# Altium project STM32VET6_board.PrjPcb
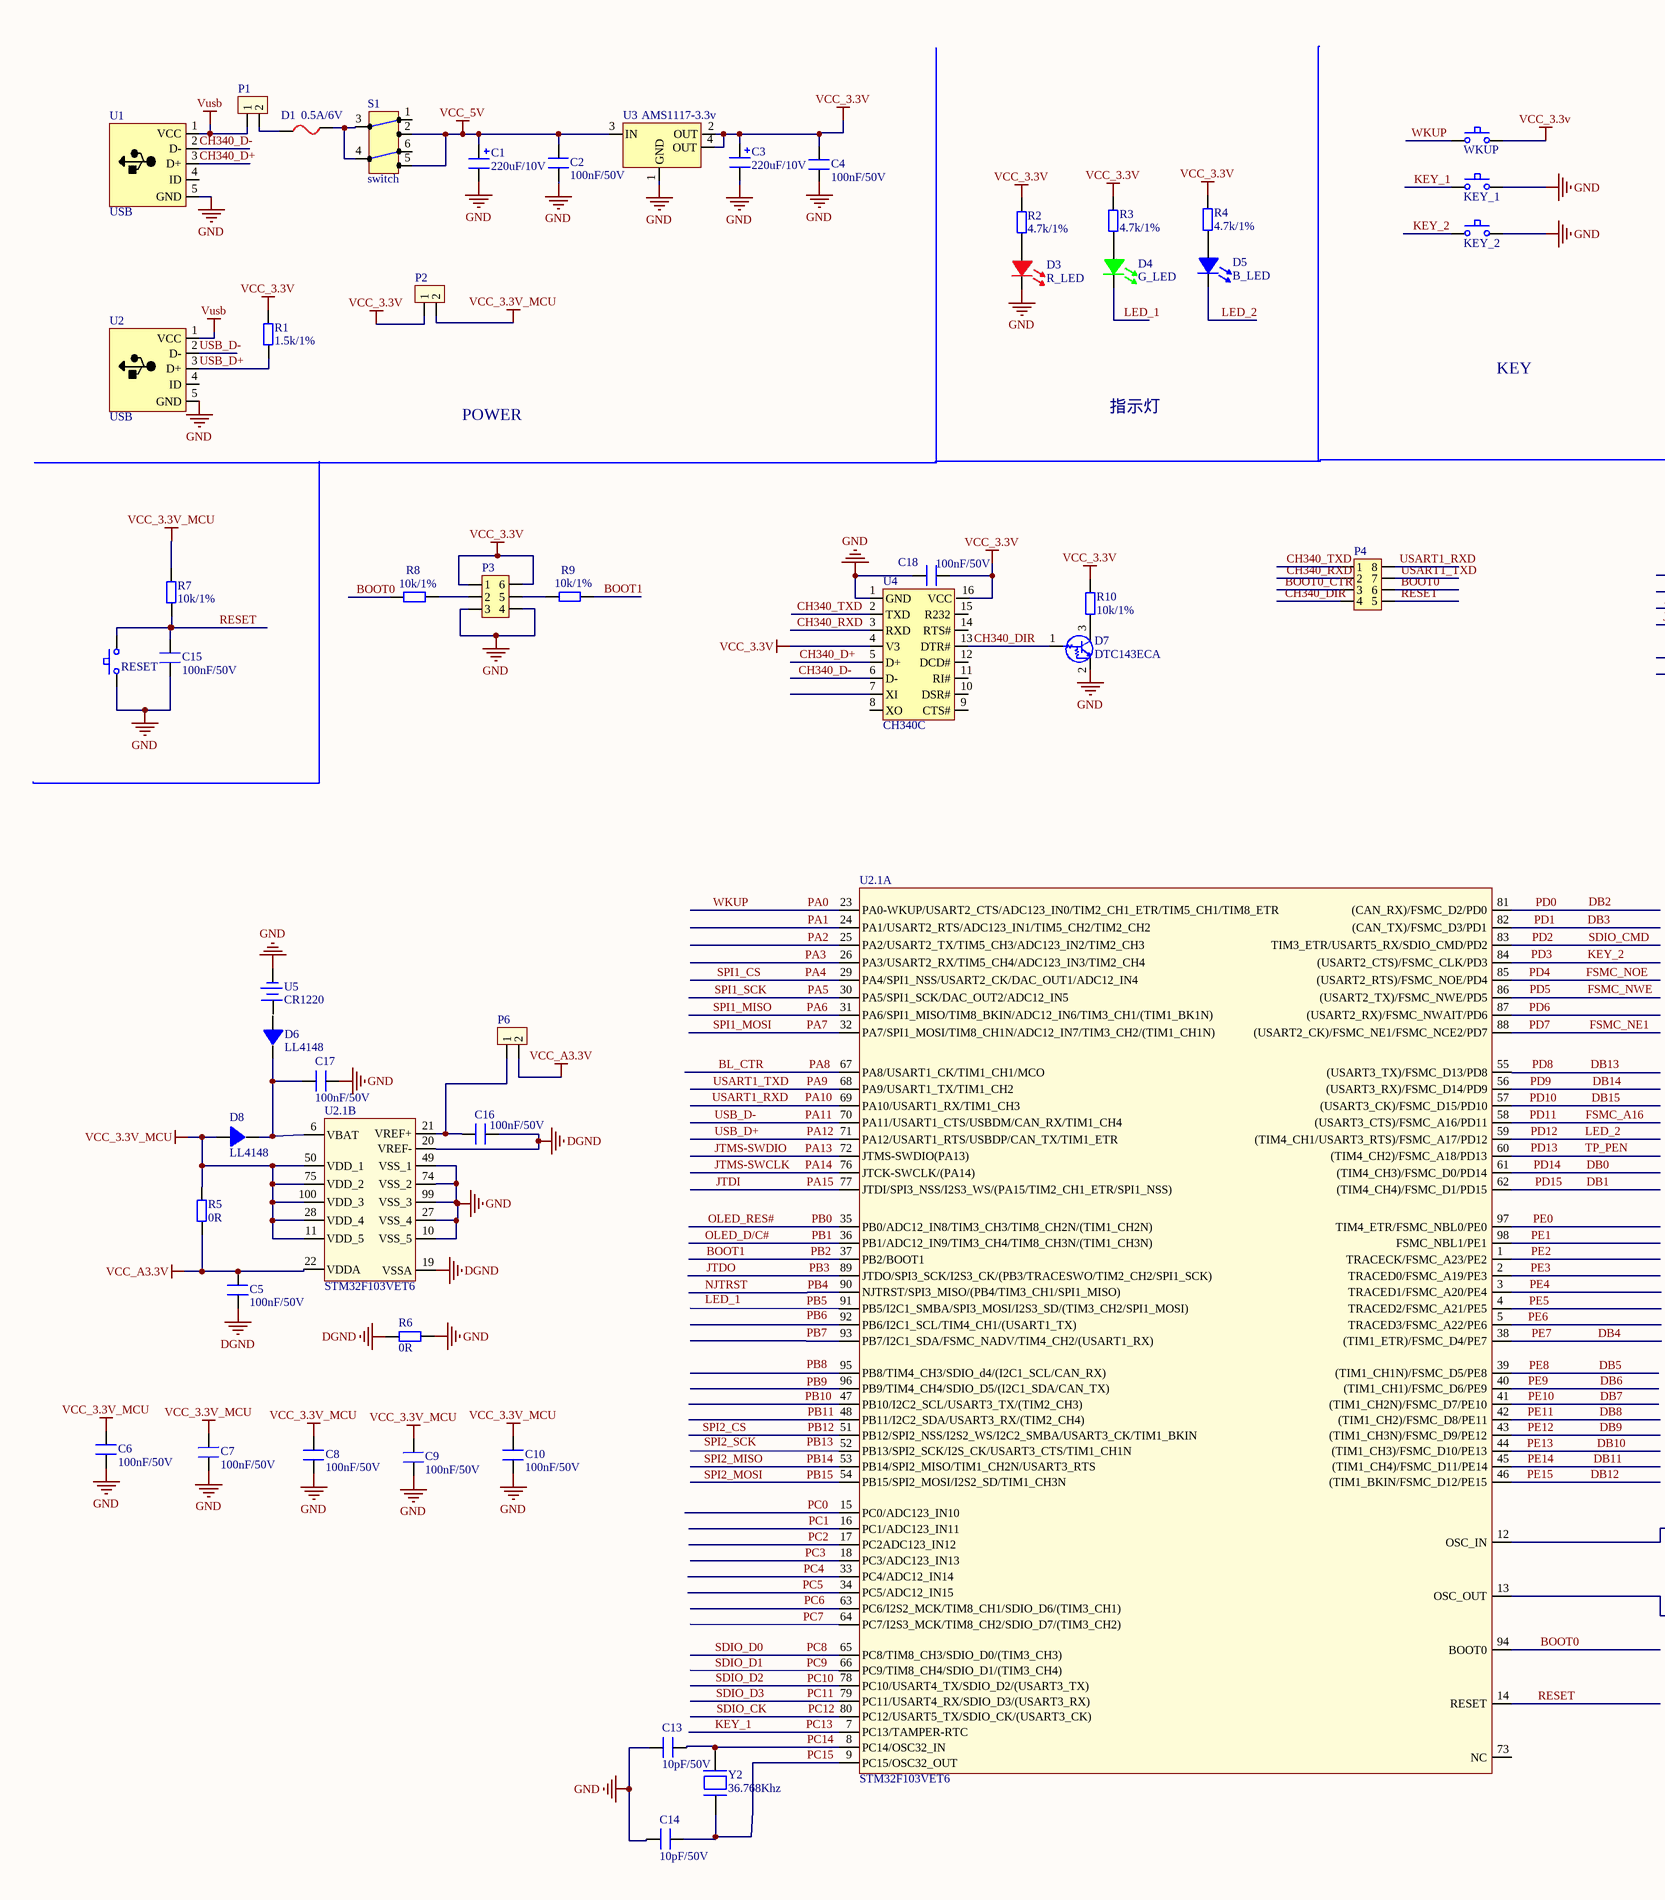
[diagram p0: STM32VET6_SCH.SchDoc, left]
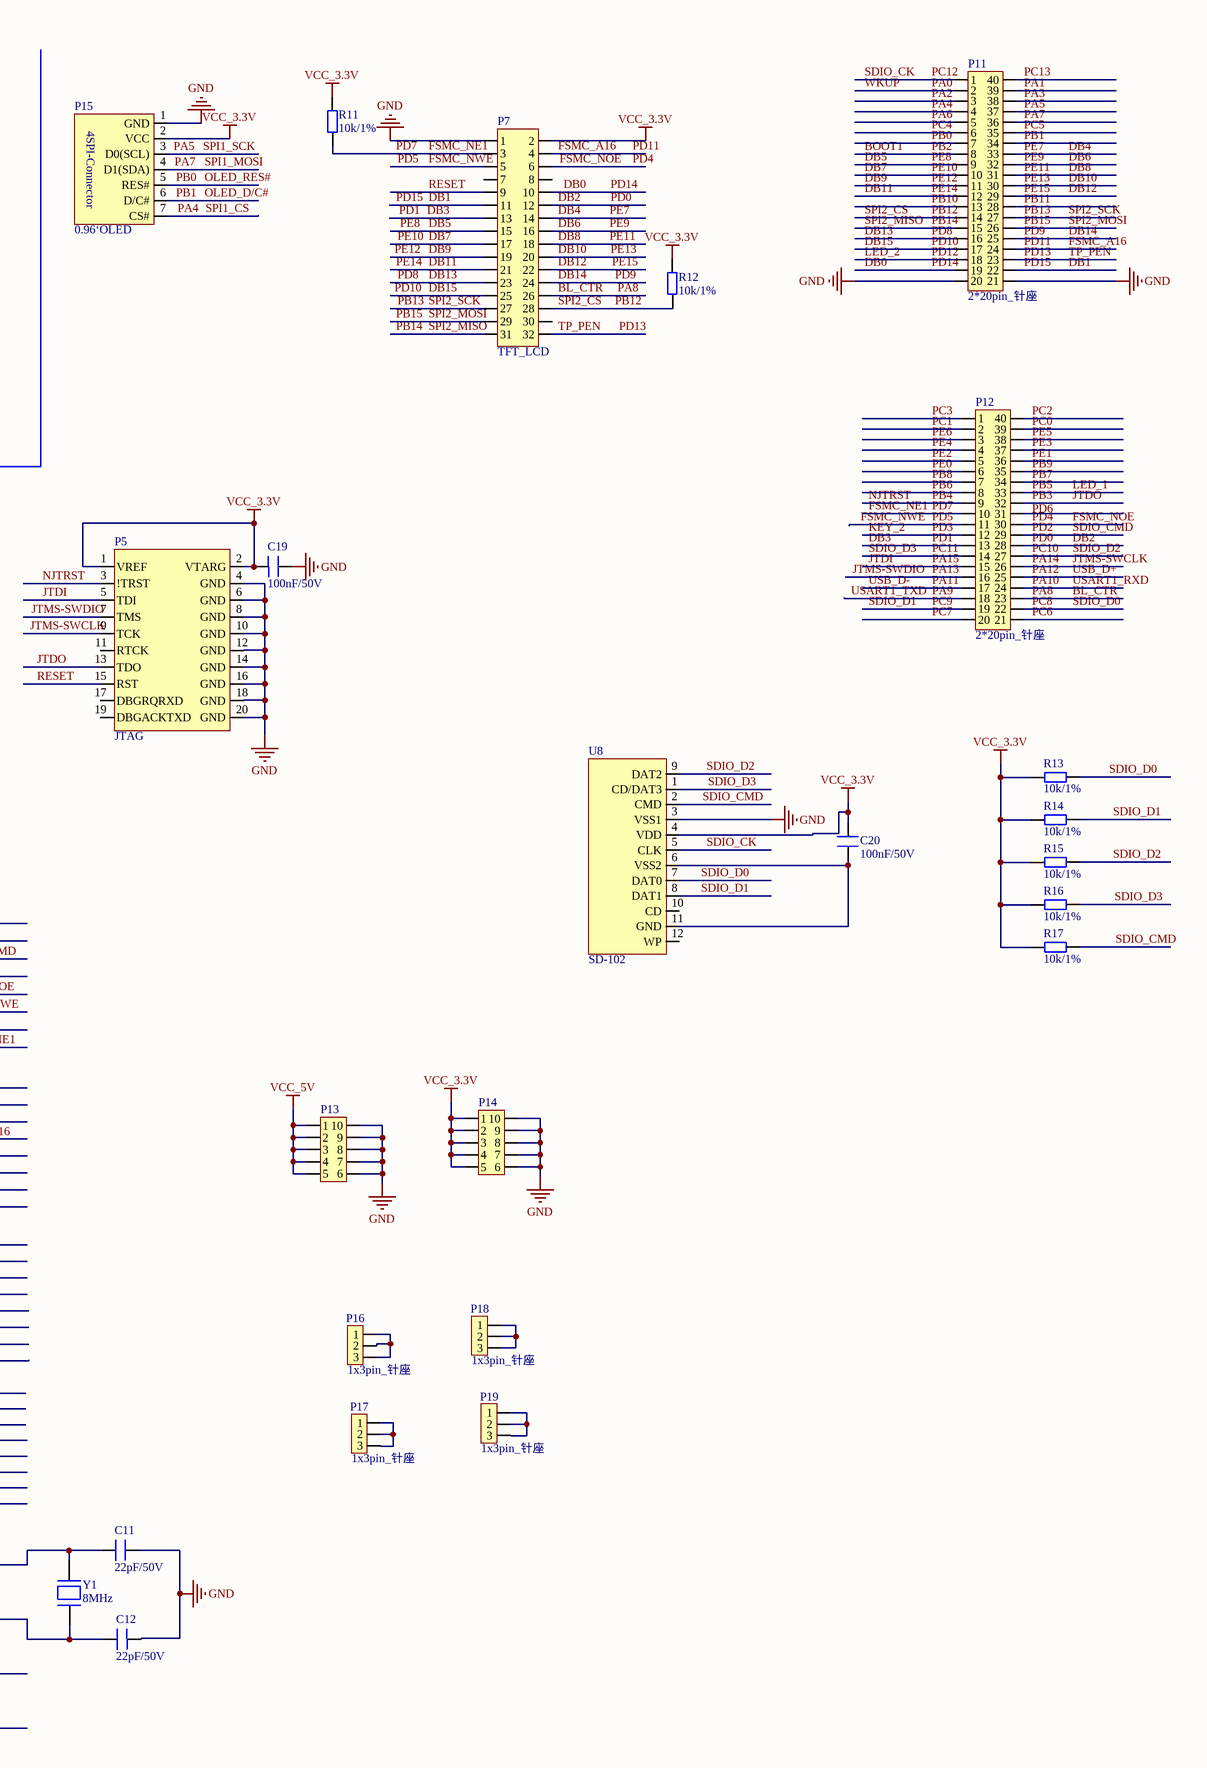
[diagram p1: STM32VET6_SCH.SchDoc, right]
1 sheet, 74 parts. Net scope: global (net labels, ports and power ports of the same name join across sheets).
Board file: STM32VET6_PCB.PcbDoc

## Sheet STM32VET6_SCH.SchDoc
size A2

### Parts
C1  220uF/10V  [CT 6*6 - C]
C2  100nF/50V  [0603_C]
C3  220uF/10V  [CT 6*6 - C]
C4  100nF/50V  [0603_C]
C5  100nF/50V  [0603_C]
C6  100nF/50V  [0603_C]
C7  100nF/50V  [0603_C]
C8  100nF/50V  [0603_C]
C9  100nF/50V  [0603_C]
C10  100nF/50V  [0603_C]
C11  22pF/50V  [0603_C]
C12  22pF/50V  [0603_C]
C13  10pF/50V  [0603_C]
C14  10pF/50V  [0603_C]
C15  100nF/50V  [0603_C]
C16  100nF/50V  [0603_C]
C17  100nF/50V  [0603_C]
C18  100nF/50V  [0603_C]
C19  100nF/50V  [0603_C]
C20  100nF/50V  [0603_C]
D1  0.5A/6V  [0805_D]
D3  R_LED  [0603_R]
D4  G_LED  [0603_R]
D5  B_LED  [0603_R]
D6  LL4148  [LL4148]
D7  DTC143ECA  [SOT23]
D8  LL4148  [LL4148]
key0  WKUP  [TSW SMD-3*6*5]
Key1  KEY_1  [TSW SMD-3*6*5]
Key2  KEY_2  [TSW SMD-3*6*5]
key_4  RESET  [TSW SMD-3*6*5]
P1  2P_排针  [HDR2.54-LI-2P]  (value not drawn)
P2  2P_排针  [HDR2.54-LI-2P]  (value not drawn)
P3  2*3Pin_插针  [HDR2.54-LI-2x3P]  (value not drawn)
P4  2x4pin_插针  [HDR2.54-LI-2x4P]  (value not drawn)
P5  JTAG  [DC-2.54-L-Z-20P]
P6  2P_排针  [HDR2.54-LI-2P]  (value not drawn)
P7  TFT_LCD  [HDR2.54-M-2x16P]
P11  2*20pin_针座  [HDR2.54-LI-2x20P]
P12  2*20pin_针座  [HDR2.54-LI-2x20P]
P13  2x5pin_针座  [HDR2.54-LI-2x5P]  (value not drawn)
P14  2x5pin_针座  [HDR2.54-LI-2x5P]  (value not drawn)
P15  0.96‘OLED  [0.96'OLED]
P16  1x3pin_针座  [HDR2.54-LI-3P]
P17  1x3pin_针座  [HDR2.54-LI-3P]
P18  1x3pin_针座  [HDR2.54-LI-3P]
P19  1x3pin_针座  [HDR2.54-LI-3P]
R1  1.5k/1%  [0603_R]
R2  4.7k/1%  [0603_R]
R3  4.7k/1%  [0603_R]
R4  4.7k/1%  [0603_R]
R5  0R  [0603_R]
R6  0R  [0603_R]
R7  10k/1%  [0603_R]
R8  10k/1%  [0603_R]
R9  10k/1%  [0603_R]
R10  10k/1%  [0603_R]
R11  10k/1%  [0603_R]
R12  10k/1%  [0603_R]
R13  10k/1%  [0603_R]
R14  10k/1%  [0603_R]
R15  10k/1%  [0603_R]
R16  10k/1%  [0603_R]
R17  10k/1%  [0603_R]
S1  switch  [KFT DIP-8X8]
U1  USB  [USB-MINI-5P]
U2  USB  [USB-MINI-5P]
U2.1  STM32F103VET6  [STM32F103VET6]  (parts A,B of 2)
U3  AMS1117-3.3v  [SOT-223]
U4  CH340C  [SOP16]
U5  CR1220  [CR1220]
U8  SD-102  [SDCARD_L]
Y1  8MHz  [8Mhz]
Y2  36.768Khz  [32.768Khz晶振]

### Nets
DGND: C5.1 C16.2 R6.2 U2.1.19(VSSA) U2.1.20(VREF-)
GND: C1.2 C2.1 C3.2 C6.1 C7.1 C8.1 C9.1 C10.1 C11.2 C12.2 C13.1 C14.1 C15.1 C17.2 C18.1 C19.2 D3.2 D7.2 Key1.2 Key2.2 key_4.1 P3.3 P3.4 P5.4(GND) P5.6(GND) P5.8(GND) P5.10(GND) P5.12(GND) P5.14(GND) P5.16(GND) P5.18(GND) P5.20(GND) P7.1 P11.20 P11.21 P13.6 P13.7 P13.8 P13.9 P13.10 P14.6 P14.7 P14.8 P14.9 P14.10 P15.1(GND) R6.1 U1.5(GND) U2.5(GND) U2.1.10(VSS_5) U2.1.27(VSS_4) U2.1.49(VSS_1) U2.1.74(VSS_2) U2.1.99(VSS_3) U3.1(GND) U4.1(GND) U5.2 U8.3(VSS1)
VCC_3.3V: C3.1 C4.2 C18.2 C19.1 C20.2 key0.2 P2.1 P3.1 P3.6 P5.1(VREF) P5.2(VTARG) P7.2 P14.1 P14.2 P14.3 P14.4 P14.5 P15.2(VCC) R1.2 R2.2 R3.2 R4.2 R10.1 R11.2 R12.2 R13.2 R14.2 R15.2 R16.2 R17.2 U3.2(OUT) U3.4(OUT) U4.4(V3) U4.16(VCC) U8.4(VDD)
VCC_3.3V_MCU: C6.2 C7.2 C8.2 C9.2 C10.2 D8.1 P2.2 R5.2 R7.2 U2.1.11(VDD_5) U2.1.28(VDD_4) U2.1.50(VDD_1) U2.1.75(VDD_2) U2.1.100(VDD_3)
VCC_5V: C1.1 C2.2 P13.1 P13.2 P13.3 P13.4 P13.5 S1.2 S1.5 U3.3(IN)
VCC_A3.3V: C5.2 P6.2 R5.1 U2.1.22(VDDA)
Vusb: P1.1 U1.1(VCC) U2.1(VCC)
BL_CTR: P7.26 P12.23 U2.1.67(PA8/USART1_CK/TIM1_CH1/MCO)  [also labelled PA8]
BOOT0: P4.6 R8.2 U2.1.94(BOOT0)
BOOT0_CTR: P4.3
BOOT1: P11.8 R9.1 U2.1.37(PB2/BOOT1)  [also labelled PB2]
CH340_D+: U1.3(D+) U4.5(D+)
CH340_D-: U1.2(D-) U4.6(D-)
CH340_DIR: D7.1 P4.4 U4.13(DTR#)
CH340_RXD: P4.2 U4.3(RXD)
CH340_TXD: P4.1 U4.2(TXD)
DB0: P7.10 P11.19 U2.1.61((TIM4_CH3)/FSMC_D0/PD14)  [also labelled PD14]
DB1: P7.11 P11.22 U2.1.62((TIM4_CH4)/FSMC_D1/PD15)  [also labelled PD15]
DB2: P7.12 P12.28 U2.1.81((CAN_RX)/FSMC_D2/PD0)  [also labelled PD0]
DB3: P7.13 P12.13 U2.1.82((CAN_TX)/FSMC_D3/PD1)  [also labelled PD1]
DB4: P7.14 P11.33 U2.1.38((TIM1_ETR)/FSMC_D4/PE7)  [also labelled PE7]
DB5: P7.15 P11.9 U2.1.39((TIM1_CH1N)/FSMC_D5/PE8)  [also labelled PE8]
DB6: P7.16 P11.32 U2.1.40((TIM1_CH1)/FSMC_D6/PE9)  [also labelled PE9]
DB7: P7.17 P11.10 U2.1.41((TIM1_CH2N)/FSMC_D7/PE10)  [also labelled PE10]
DB8: P7.18 P11.31 U2.1.42((TIM1_CH2)/FSMC_D8/PE11)  [also labelled PE11]
DB9: P7.19 P11.11 U2.1.43((TIM1_CH3N)/FSMC_D9/PE12)  [also labelled PE12]
DB10: P7.20 P11.30 U2.1.44((TIM1_CH3)/FSMC_D10/PE13)  [also labelled PE13]
DB11: P7.21 P11.12 U2.1.45((TIM1_CH4)/FSMC_D11/PE14)  [also labelled PE14]
DB12: P7.22 P11.29 U2.1.46((TIM1_BKIN/FSMC_D12/PE15)  [also labelled PE15]
DB13: P7.23 P11.16 U2.1.55((USART3_TX)/FSMC_D13/PD8)  [also labelled PD8]
DB14: P7.24 P11.25 U2.1.56((USART3_RX)/FSMC_D14/PD9)  [also labelled PD9]
DB15: P7.25 P11.17 U2.1.57((USART3_CK)/FSMC_D15/PD10)  [also labelled PD10]
FSMC_A16: P7.4 P11.24 U2.1.58((USART3_CTS)/FSMC_A16/PD11)  [also labelled PD11]
FSMC_NE1: P7.3 P12.10 R11.1 U2.1.88((USART2_CK)/FSMC_NE1/FSMC_NCE2/PD7)  [also labelled PD7]
FSMC_NOE: P7.6 P12.30 U2.1.85((USART2_RTS)/FSMC_NOE/PD4)  [also labelled PD4]
FSMC_NWE: P7.5 P12.11 U2.1.86((USART2_TX)/FSMC_NWE/PD5)  [also labelled PD5]
JTDI: P5.5(TDI) P12.15 U2.1.77(JTDI/SPI3_NSS/I2S3_WS/(PA15/TIM2_CH1_ETR/SPI1_NSS))  [also labelled PA15]
JTDO: P5.13(TDO) P12.32 U2.1.89(JTDO/SPI3_SCK/I2S3_CK/(PB3/TRACESWO/TIM2_CH2/SPI1_SCK))  [also labelled PB3]
JTMS-SWCLK: P5.9(TCK) P12.26 U2.1.76(JTCK-SWCLK/(PA14))  [also labelled PA14]
JTMS-SWDIO: P5.7(TMS) P12.16 U2.1.72(JTMS-SWDIO(PA13))  [also labelled PA13]
KEY_1: Key1.1 P11.40 U2.1.7(PC13/TAMPER-RTC)  [also labelled PC13]
KEY_2: Key2.1 P12.12 U2.1.84((USART2_CTS)/FSMC_CLK/PD3)  [also labelled PD3]
LED_1: D4.2 P12.33 U2.1.91(PB5/I2C1_SMBA/SPI3_MOSI/I2S3_SD/(TIM3_CH2/SPI1_MOSI))  [also labelled PB5]
LED_2: D5.2 P11.18 U2.1.59((TIM4_CH1/USART3_RTS)/FSMC_A17/PD12)  [also labelled PD12]
NJTRST: P5.3(!TRST) P12.9 U2.1.90(NJTRST/SPI3_MISO/(PB4/TIM3_CH1/SPI1_MISO))  [also labelled PB4]
OLED_D/C#: P11.34 P15.6(D/C#) U2.1.36(PB1/ADC12_IN9/TIM3_CH4/TIM8_CH3N/(TIM1_CH3N))  [also labelled PB1]
OLED_RES#: P11.7 P15.5(RES#) U2.1.35(PB0/ADC12_IN8/TIM3_CH3/TIM8_CH2N/(TIM1_CH2N))  [also labelled PB0]
PA0: key0.1 P11.2 U2.1.23(PA0-WKUP/USART2_CTS/ADC123_IN0/TIM2_CH1_ETR/TIM5_CH1/TIM8_ETR)  [also labelled WKUP]
PA1: P11.39 U2.1.24(PA1/USART2_RTS/ADC123_IN1/TIM5_CH2/TIM2_CH2)
PA2: P11.3 U2.1.25(PA2/USART2_TX/TIM5_CH3/ADC123_IN2/TIM2_CH3)
PA3: P11.38 U2.1.26(PA3/USART2_RX/TIM5_CH4/ADC123_IN3/TIM2_CH4)
PA4: P11.4 P15.7(CS#) U2.1.29(PA4/SPI1_NSS/USART2_CK/DAC_OUT1/ADC12_IN4)  [also labelled SPI1_CS]
PA5: P11.37 P15.3(D0(SCL)) U2.1.30(PA5/SPI1_SCK/DAC_OUT2/ADC12_IN5)  [also labelled SPI1_SCK]
PA6: P11.5 U2.1.31(PA6/SPI1_MISO/TIM8_BKIN/ADC12_IN6/TIM3_CH1/(TIM1_BK1N))  [also labelled SPI1_MISO]
PA7: P11.36 P15.4(D1(SDA)) U2.1.32(PA7/SPI1_MOSI/TIM8_CH1N/ADC12_IN7/TIM3_CH2/(TIM1_CH1N))  [also labelled SPI1_MOSI]
PA9: P4.7 P12.18 U2.1.68(PA9/USART1_TX/TIM1_CH2)  [also labelled USART1_TXD]
PA10: P4.8 P12.24  [also labelled USART1_RXD]
PA11: P12.17 U2.2(D-) U2.1.70(PA11/USART1_CTS/USBDM/CAN_RX/TIM1_CH4)  [also labelled USB_D-]
PA12: P12.25 R1.1 U2.3(D+) U2.1.71(PA12/USART1_RTS/USBDP/CAN_TX/TIM1_ETR)  [also labelled USB_D+]
PB6: P12.8
PB7: P12.34 U2.1.93(PB7/I2C1_SDA/FSMC_NADV/TIM4_CH2/(USART1_RX))
PB8: P12.7
PB9: P12.35
PB10: P11.13 U2.1.47(PB10/I2C2_SCL/USART3_TX/(TIM2_CH3))
PB11: P11.28 U2.1.48(PB11/I2C2_SDA/USART3_RX/(TIM2_CH4))
PB12: P7.28 P11.14 R12.1 U2.1.51(PB12/SPI2_NSS/I2S2_WS/I2C2_SMBA/USART3_CK/TIM1_BKIN)  [also labelled SPI2_CS]
PB13: P7.27 P11.27  [also labelled SPI2_SCK]
PB14: P7.31 P11.15 U2.1.53(PB14/SPI2_MISO/TIM1_CH2N/USART3_RTS)  [also labelled SPI2_MISO]
PB15: P7.29 P11.26  [also labelled SPI2_MOSI]
PC0: P12.39 U2.1.15(PC0/ADC123_IN10)
PC1: P12.2 U2.1.16(PC1/ADC123_IN11)
PC2: P12.40 U2.1.17(PC2ADC123_IN12)
PC3: P12.1 U2.1.18(PC3/ADC123_IN13)
PC4: P11.6 U2.1.33(PC4/ADC12_IN14)
PC5: P11.35 U2.1.34(PC5/ADC12_IN15)
PC6: P12.21 U2.1.63(PC6/I2S2_MCK/TIM8_CH1/SDIO_D6/(TIM3_CH1))
PC7: P12.20 U2.1.64(PC7/I2S3_MCK/TIM8_CH2/SDIO_D7/(TIM3_CH2))
PC8: P12.22 R13.1 U2.1.65(PC8/TIM8_CH3/SDIO_D0/(TIM3_CH3)) U8.7(DAT0)  [also labelled SDIO_D0]
PC9: P12.19 R14.1 U2.1.66(PC9/TIM8_CH4/SDIO_D1/(TIM3_CH4)) U8.8(DAT1)  [also labelled SDIO_D1]
PC10: P12.27 R15.1 U2.1.78(PC10/USART4_TX/SDIO_D2/(USART3_TX)) U8.9(DAT2)  [also labelled SDIO_D2]
PC11: P12.14 R16.1 U2.1.79(PC11/USART4_RX/SDIO_D3/(USART3_RX)) U8.1(CD/DAT3)  [also labelled SDIO_D3]
PC12: P11.1 U2.1.80(PC12/USART5_TX/SDIO_CK/(USART3_CK)) U8.5(CLK)  [also labelled SDIO_CK]
PC14: C13.2 U2.1.8(PC14/OSC32_IN) Y2.1
PC15: C14.2 U2.1.9(PC15/OSC32_OUT) Y2.2
PD2: P12.29 R17.1 U2.1.83(TIM3_ETR/USART5_RX/SDIO_CMD/PD2) U8.2(CMD)  [also labelled SDIO_CMD]
PD6: U2.1.87((USART2_RX)/FSMC_NWAIT/PD6)
PD13: P7.32 P11.23 U2.1.60((TIM4_CH2)/FSMC_A18/PD13)  [also labelled TP_PEN]
PE0: P12.6 U2.1.97(TIM4_ETR/FSMC_NBL0/PE0)
PE1: P12.36 U2.1.98(FSMC_NBL1/PE1)
PE2: P12.5 U2.1.1(TRACECK/FSMC_A23/PE2)
PE3: P12.37 U2.1.2(TRACED0/FSMC_A19/PE3)
PE4: P12.4 U2.1.3(TRACED1/FSMC_A20/PE4)
PE5: P12.38 U2.1.4(TRACED2/FSMC_A21/PE5)
PE6: P12.3 U2.1.5(TRACED3/FSMC_A22/PE6)
RESET: C15.2 key_4.2 P4.5 P5.15(RST) P7.9 R7.1 U2.1.14(RESET)
NetC11_1: C11.1 U2.1.12(OSC_IN) Y1.1
NetC12_1: C12.1 U2.1.13(OSC_OUT) Y1.2
NetC16_1: C16.1 P6.1 U2.1.21(VREF+)
NetC17_1: C17.1 D6.2 D8.2 U2.1.6(VBAT)
NetC20_1: C20.1 U8.6(VSS2) U8.11(GND)
NetD1_1: D1.1 P1.2
NetD1_2: D1.2 S1.3 S1.4
NetD3_1: D3.1 R2.1
NetD4_1: D4.1 R3.1
NetD5_1: D5.1 R4.1
NetD7_3: D7.3 R10.2
NetP3_2: P3.2 R8.1
NetP3_5: P3.5 R9.2
NetP16_1: P16.1 P16.2 P16.3
NetP17_1: P17.1 P17.2 P17.3
NetP18_1: P18.1 P18.2 P18.3
NetP19_1: P19.1 P19.2 P19.3

Not connected (* = marked no-connect by the designer): C4 1; D6 1; P5 11(RTCK) 17(DBGRQRXD) 19(DBGACKTXD); P7 7 8 30; P12 31; S1 1 6; U1 4(ID); U2 4(ID); U2.1 52(PB13/SPI2_SCK/I2S_CK/USART3_CTS/TIM1_CH1N) 54(PB15/SPI2_MOSI/I2S2_SD/TIM1_CH3N) 69(PA10/USART1_RX/TIM1_CH3) 73(NC) 92(PB6/I2C1_SCL/TIM4_CH1/(USART1_TX)) 95(PB8/TIM4_CH3/SDIO_d4/(I2C1_SCL/CAN_RX)) 96(PB9/TIM4_CH4/SDIO_D5/(I2C1_SDA/CAN_TX)); U4 7(XI) 8(XO) 9(CTS#) 10(DSR#) 11(RI#) 12(DCD#) 14(RTS#) 15(R232); U5 1; U8 10(CD) 12(WP)

### Notes on the sheet
- KEY
- POWER
- 指示灯
- Labels drawn without touching a wire or pin: GND, LED_1, PA10, PB6, PB8, PB9, PB13, PB15, PD6, SPI2_MOSI, SPI2_SCK, USART1_RXD
- (in symbol 0.96'OLED) 4SPI-Connector

### Library data of the parts
C1 C3 = 220uF/10V: 6.3*5.4
C2 C4-C10 C15-C20 = 100nF_C
C11 C12 = 22pF_C
C13 C14 = 10pF_C
D1 = 0.5A/6V保险丝
D3 = Red_LED
D4 = Green_LED
D5 = Blue_LED
D7 = DTC143ECA_三极管
key0 Key1 Key2 key_4 = key
P5 = JTAG_20pin
P7 = 2*16pin_母座
P15 = 0.96'OLED
R1 = 1.5k_R
R2-R4 = 4.7k_R
R5 R6 = 0R_R
R7-R17 = 10k_R
S1 = 自锁开关
U1 U2 = mini-USB
U2.1 = STM32F103VET6: LQFP100
Y1 = 8MHz晶振